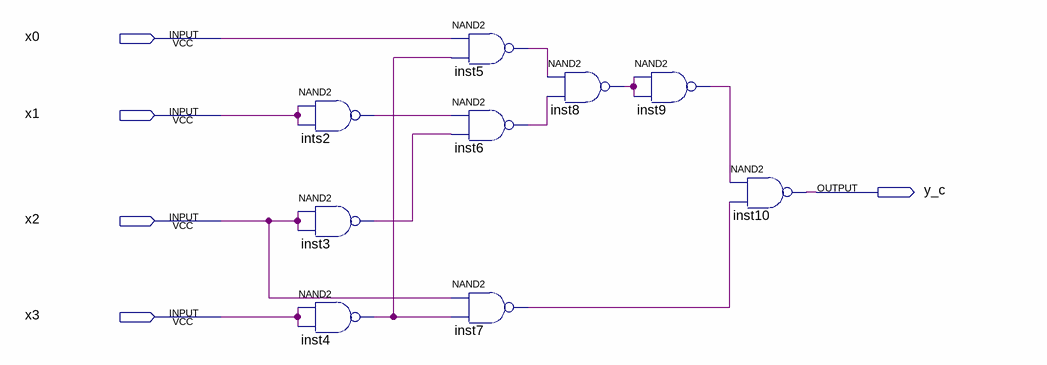
[diagram p0: schematic sheet]
// Quartus schematic y_c.bdf as structural Verilog: 9 symbols, 5 pins
module y_c (
  input  x0,
  input  x1,
  input  x2,
  input  x3,
  output y_c
);

  wire inst3_out, inst4_out, inst5_out, inst6_out, inst7_out, inst8_out, inst9_out, ints2_out;

  nand ints2 (ints2_out, x1, x1);
  nand inst3 (inst3_out, x2, x2);
  nand inst4 (inst4_out, x3, x3);
  nand inst5 (inst5_out, x0, inst4_out);
  nand inst6 (inst6_out, ints2_out, inst3_out);
  nand inst7 (inst7_out, x2, inst4_out);
  nand inst8 (inst8_out, inst5_out, inst6_out);
  nand inst9 (inst9_out, inst8_out, inst8_out);
  nand inst10 (y_c, inst9_out, inst7_out);
endmodule
